# EAGLE design avr_programming_shield_v12 (EAGLE 6.3)
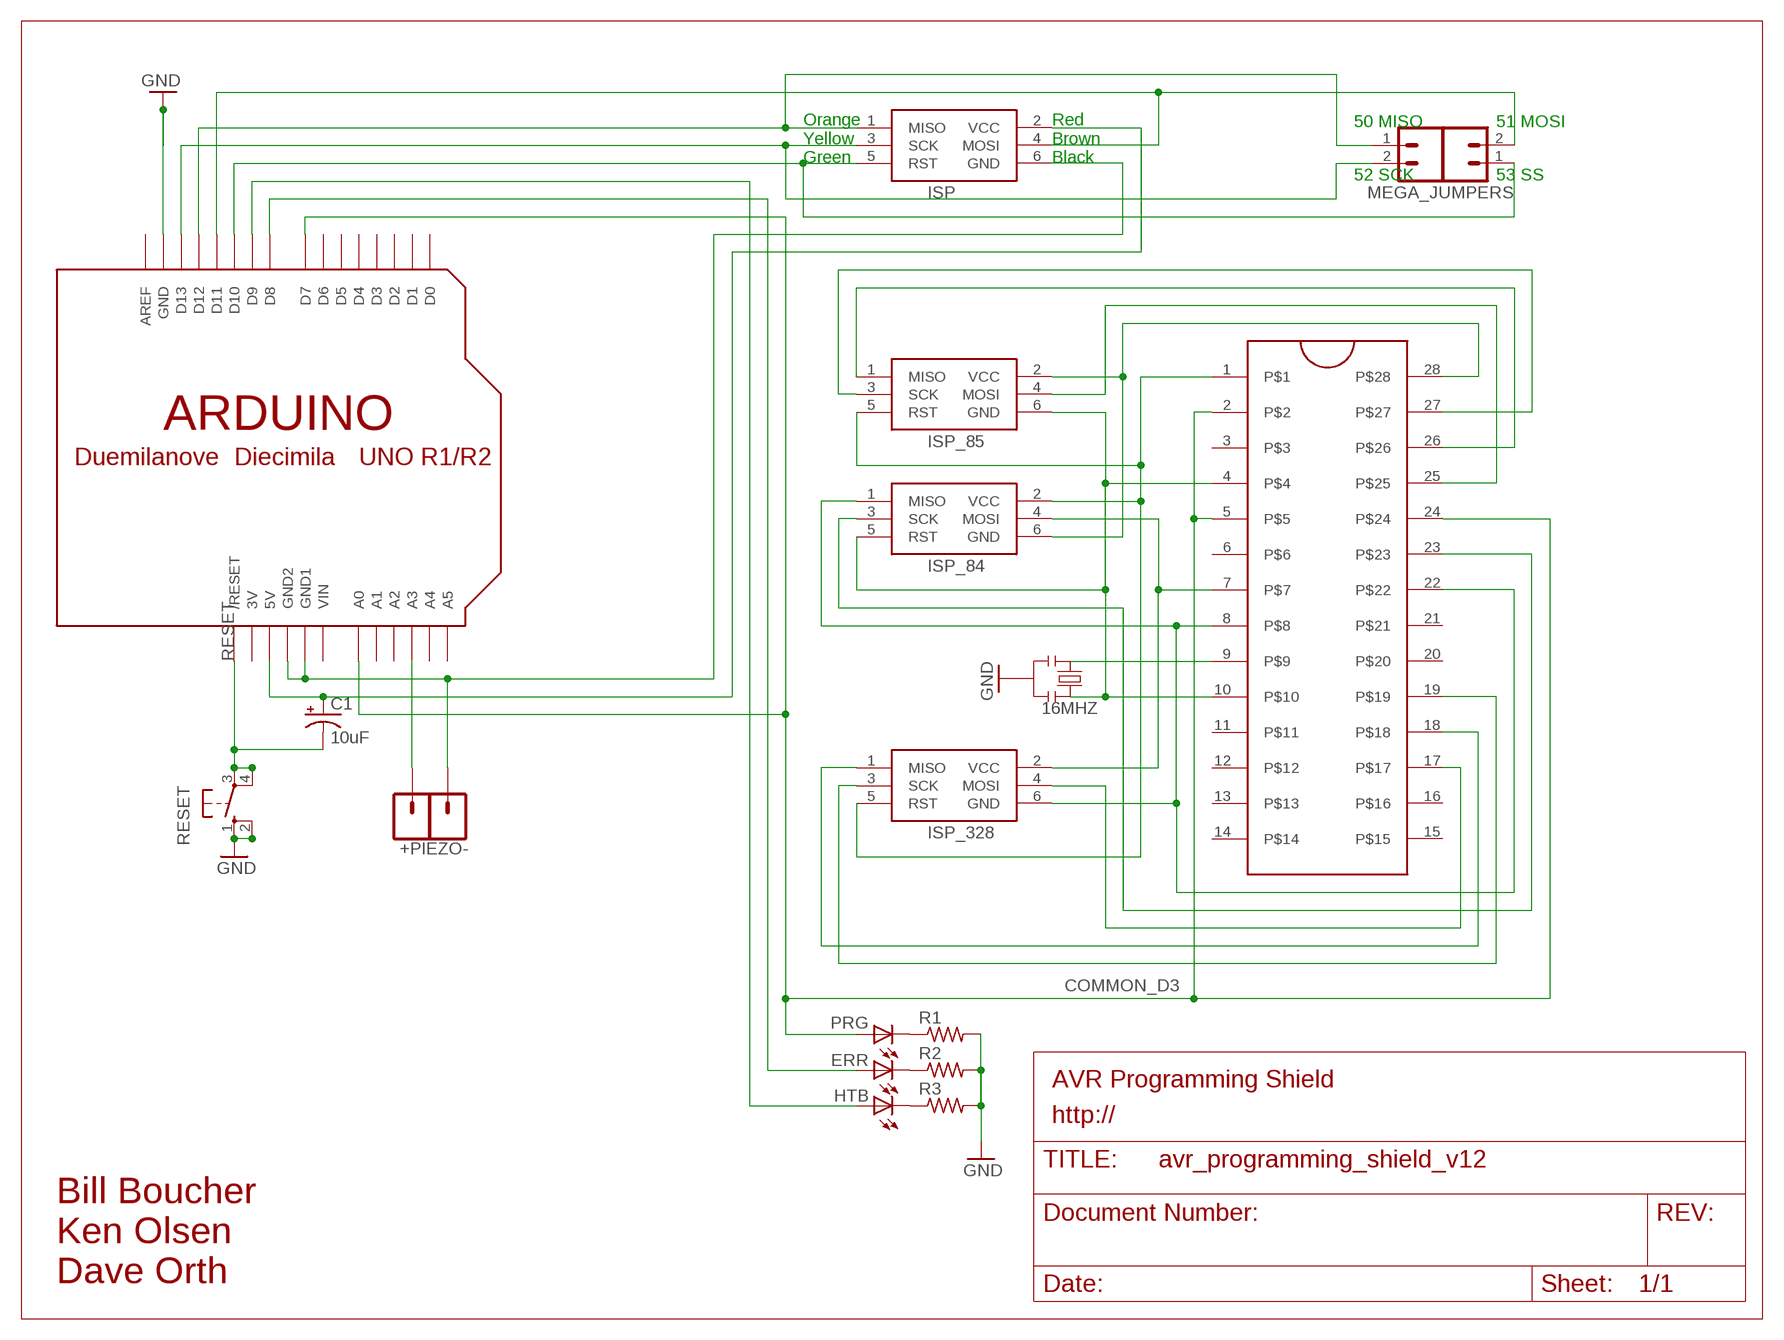
[diagram p0: schematic, sheet 1]

## Parts
16MHZ  RESONATORPTH  [RESONATOR-PTH]
+PIEZO-  M01PTH  [1X01]
C1  10uF  CAP_POLPTH2  [CPOL-RADIAL-10UF-25V]
ERR  LED3MM  [LED3MM]
HTB  LED3MM  [LED3MM]
ISP  AVRISP-6  [AVRISP]
ISP_84  AVRISP-6  [AVRISP]
ISP_85  AVRISP-6  [AVRISP]
ISP_328  AVRISP-6  [AVRISP]
JP2  M02PTH  [1X02]
JP4  M01PTH  [1X01]
MEGA_JUMPERS  M02PTH  [1X02]
PRG  LED3MM  [LED3MM]
R1  R-US_0207/7  [0207/7]
R2  R-US_0207/7  [0207/7]
R3  R-US_0207/7  [0207/7]
RESET  10-XX  [B3F-10XX]
U$4  ZIFSOCKET-28-3ZIFFSOCKET-28-3  [DIL28-3-ZIF_SOCKET]
U$5  ARDUINO-NOHOLE  [ARDUINO-NOHOLE]

## Nets
COMMON_D3: PRG.A U$4.2 U$4.5 U$4.24 U$5.A0 U$5.D7
GND [power]: 16MHZ.2 +PIEZO-.1 ISP.6(GND) R1.2 R2.2 R3.2 RESET.1(S) RESET.2(S1) U$5.GND U$5.GND1 U$5.GND2
N$1: ISP_328.4(MOSI) U$4.17
N$2: ISP.3(SCK) MEGA_JUMPERS.2 U$5.D13
N$3: ISP.1(MISO) MEGA_JUMPERS.1 U$5.D12
N$4: ISP_328.1(MISO) U$4.18
N$5: ISP.5(RST) JP2.1 U$5.D10
N$6: ISP.4(MOSI) JP2.2 U$5.D11
N$7: ISP_328.3(SCK) U$4.19
N$8: PRG.K(C) R1.1
N$9: ERR.K(C) R2.1
N$10: HTB.K(C) R3.1
N$11: ISP_84.4(MOSI) ISP_328.2(VCC) U$4.7
N$12: JP4.1 U$5.A3
N$13: ISP_84.2(VCC) ISP_85.5(RST) ISP_328.5(RST) U$4.1
N$15: ISP_84.3(SCK) U$4.23
N$16: ISP_84.6(GND) ISP_85.2(VCC) U$4.28
N$17: HTB.A U$5.D9
N$18: 16MHZ.3 ISP_84.5(RST) ISP_85.6(GND) U$4.4 U$4.10
N$19: ISP_85.4(MOSI) U$4.25
N$20: ISP_85.1(MISO) U$4.26
N$21: ISP_85.3(SCK) U$4.27
N$22: 16MHZ.1 U$4.9
N$24: ERR.A U$5.D8
N$26: ISP_84.1(MISO) ISP_328.6(GND) U$4.8 U$4.22
RESET: C1.2(-) RESET.3(P) RESET.4(P1) U$5.RESET(/RESET)
VCC: C1.1(+) ISP.2(VCC) U$5.5V
Unconnected: U$4.3 U$4.6 U$4.11 U$4.12 U$4.13 U$4.14 U$4.15 U$4.16 U$4.20 U$4.21 U$5.A1 U$5.A2 U$5.A4 U$5.A5 U$5.AREF U$5.D0 U$5.D1 U$5.D2 U$5.D3 U$5.D4 U$5.D5 U$5.D6

## Notes on the sheet
- 50 MISO | 51 MOSI
- Orange
  Yellow
  Green
- Red
  Brown
  Black
- 52 SCK | 53 SS
- AVR Programming Shield
- http://
- Bill Boucher
  Ken Olsen
  Dave Orth

## Power pins joined to a net without a drawn wire
3V: U$5.3V
VIN: U$5.VIN

## Library data of the parts
16MHZ = SparkFun_mod:RESONATOR: Resonator Small SMD resonator. This is the itty bitty 10/20MHz resonators with built in caps. CSTCE10M0G55 and CSTCE20M0V53. Footprint has been reviewed closely but hasn't been tested yet.; OC_NEWARK: unknown
+PIEZO- JP4 = SparkFun-Connectors_mod:M01: Header 1 Standard 1-pin 0.1" header. Use with straight break away headers (SKU : PRT-00116), right angle break away headers (PRT-00553), swiss pins (PRT-00743), machine pins (PRT-00117), and female headers (PRT-00115).; OC_NEWARK: unknown
C1 = SparkFun:CAP_POL: Capacitor Polarized These are standard SMD and PTH capacitors. Normally 10uF, 47uF, and 100uF in electrolytic and tantalum varieties. Always verify the external diameter of the through hole cap, it varies with capacity, voltage, and manufacturer. The EIA devices should be standard.; MF: ILLINOIS CAPACITOR,INC.; MPN: 106TTA035M; OC_NEWARK: 30K6594
ERR HTB PRG = adafruit:LED: LED OSRAM: - CHIPLED LG R971, LG N971, LY N971, LG Q971, LY Q971, LO R971, LY R971 LH N974, LH R974 LS Q976, LO Q976, LY Q976 LO Q996 - Hyper CHIPLED LW Q18S LB Q993, LB Q99A, LB R99A - SideLED LS A670, LO A670, LY A670, LG A670, LP A670 LB A673, LV A673, LT A673, LW A673 LH A674 LY A675 LS A676, LA A676, LO A676, LY A676, LW A676 LS A679, LY A679, LG A679 - Hyper Micro SIDELED® LS Y876, LA Y876, LO Y876, LY Y876 LT Y87S - SmartLED LW L88C, LW L88S LB L89C, LB L89S, LG L890 LS L89K, LO L89K, LY L89K LS L896, LA L896, LO L896, LY L896 - TOPLED LS T670, LO T670, LY T670, LG T670, LP T670 LSG T670, LSP T670, LSY T670, LOP T670, LYG T670 LG T671, LOG T671, LSG T671 LB T673, LV T673, LT T673, LW T673 LH T674 LS T676, LA T676, LO T676, LY T676, LB T676, LH T676, LSB T676, LW T676 LB T67C, LV T67C, LT T67C, LS T67K, LO T67K, LY T67K, LW E67C LS E67B, LA E67B, LO E67B, LY E67B, LB E67C, LV E67C, LT E67C LW T67C LS T679, LY T679, LG T679 LS T770, LO T770, LY T770, LG T770, LP T770 LB T773, LV T773, LT T773, LW T773 LH T774 LS E675, LA E675, LY E675, LS T675 LS T776, LA T776, LO T776, LY T776, LB T776 LHGB T686 LT T68C, LB T68C - Hyper Mini TOPLED® LB M676 - Mini TOPLED Santana® LG M470 LS M47K, LO M47K, LY M47K Source: http://www.osram.convergy.de/; OC_NEWARK: unknown
ISP ISP_84 ISP_85 ISP_328 = adafruit:AVRISP: AVR ISP HEADER Standard 6 pin header for AVR programming; OC_NEWARK: unknown
JP2 MEGA_JUMPERS = SparkFun:M02: Header 2 Standard 2-pin 0.1" header. Use with straight break away headers (SKU : PRT-00116), right angle break away headers (PRT-00553), swiss pins (PRT-00743), machine pins (PRT-00117), and female headers (PRT-00115). Molex polarized connector foot print use with SKU : PRT-08233 with associated crimp pins and housings.; OC_NEWARK: unknown
R1-R3 = adafruit:R-US_: RESISTOR, American symbol
RESET = switch-omron:10-XX: OMRON SWITCH; MPN: B3F-1000; OC_FARNELL: 176432; OC_NEWARK: 36M3542
U$4 = SparkFun_mod:ZIFSOCKET-28-3; OC_NEWARK: unknown
U$5 = adafruit_mod:ARDUINO: Arduino Diecimila/Duemilanove Make a shield with ease, this package has all the named pins as well as the two mounting drill holes and an outline of the USB and DC power connector. The outline is on the DIMENSION layer, so if your board house uses it they will cut the outline to match. http://www.ladyada.net/library/pcb/eaglelibrary.html

## Net classes
1 power: width 0.61 mm

## Board
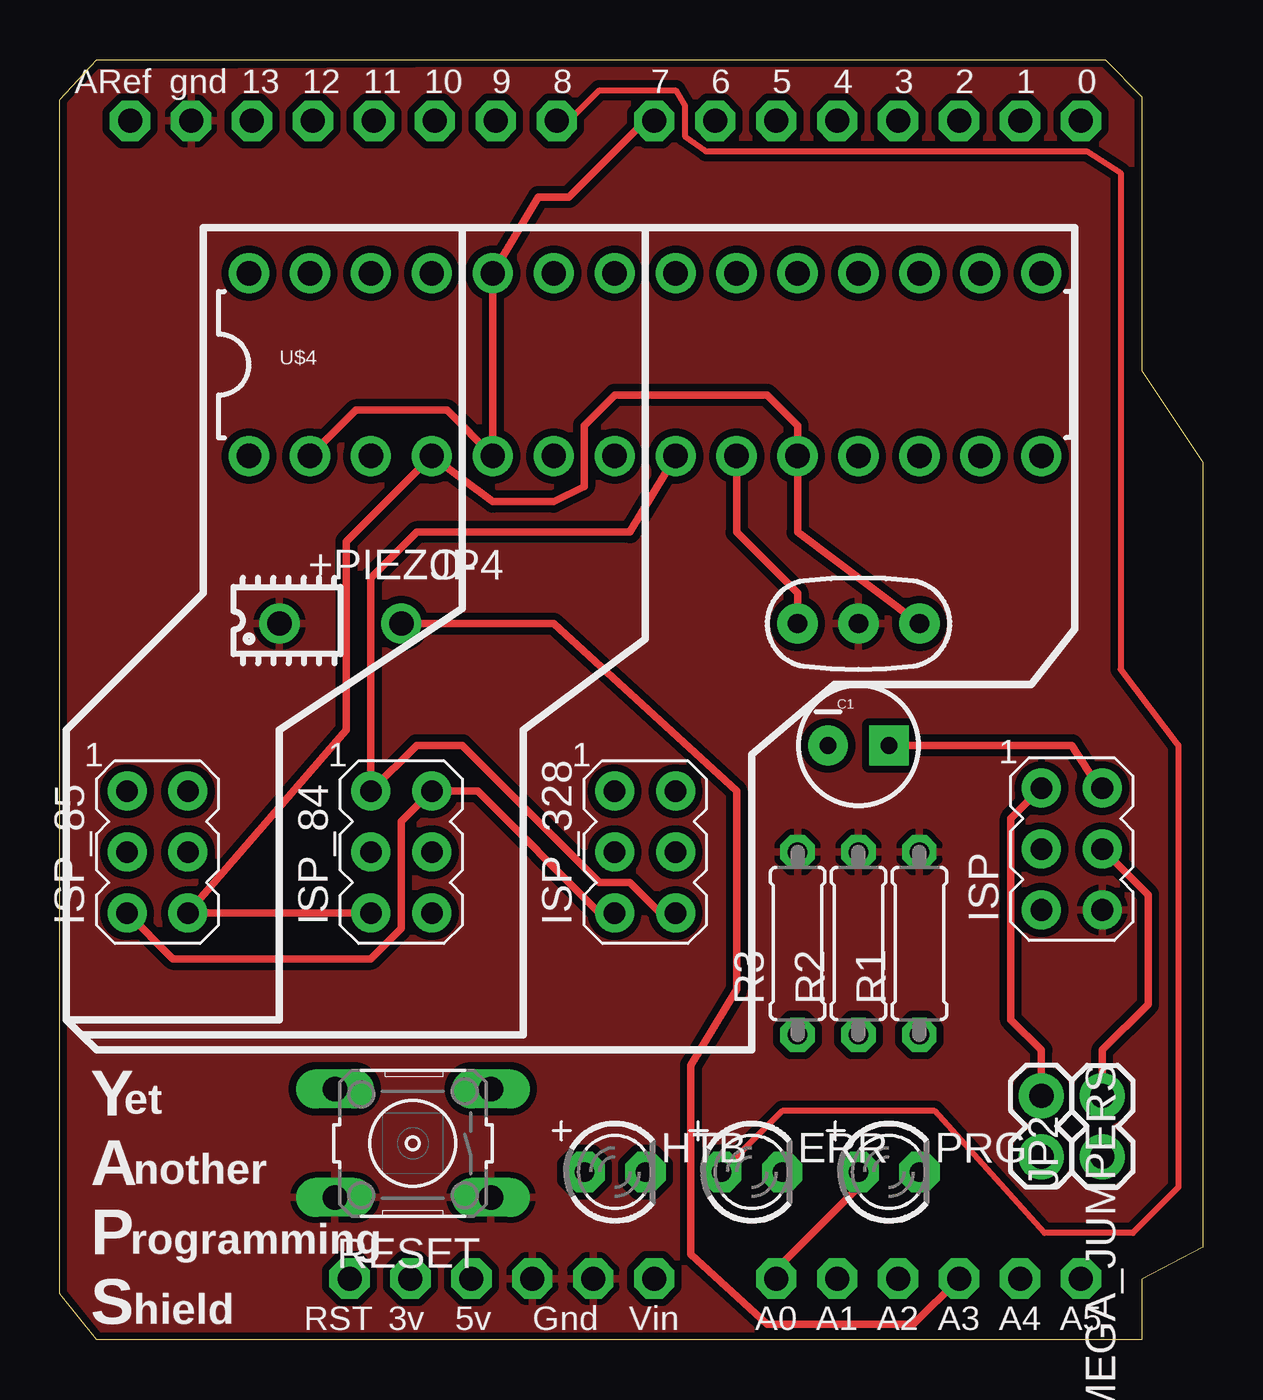
[diagram p1: board, top side]
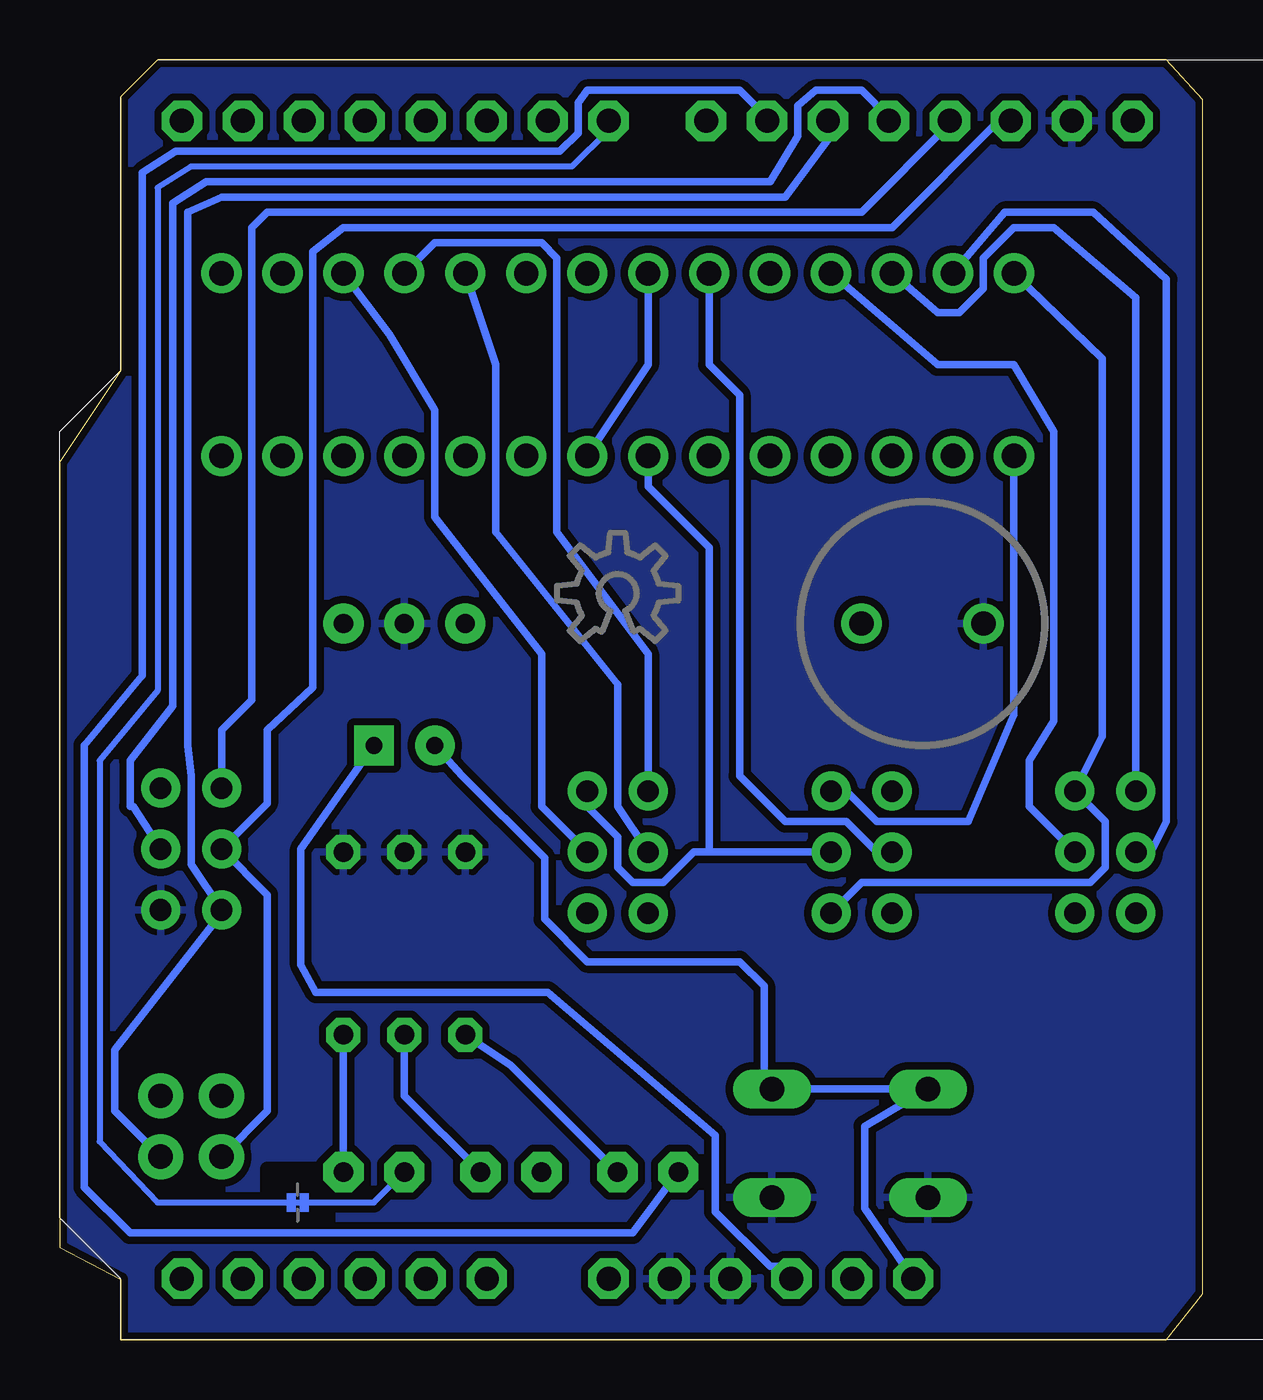
[diagram p2: board, bottom side, seen from below]

Size 47.62 x 53.34 mm. Coordinates in mm from the lower left corner, seen from the top.
Outline: 0,51.69 1.52,53.34 43.56,53.34 45.09,51.82 45.09,40.39 47.62,36.58 47.62,3.83 45.09,2.52 45.09,0 1.52,0 0,1.91 0,51.69
Copper layers (1*16): Top 0.035mm / dielectric 1.5mm / Bottom 0.035mm
Design rules "SparkFun": minimum track width 8mil, minimum drill 20mil, track to track 8mil, track to pad 8mil, pad to pad 8mil, via to via 8mil, smd to smd 8mil, copper to edge 10mil, drill to drill 8mil, minimum pad ring 12mil, minimum via ring 10mil, stop-mask expansion 4mil, vias tented up to drill 25mil, thermal gap 10mil
bRestrict: area 36.4,4.6 to 39,7.1

### Footprints (pad centres in the part's own frame; a part is rotated, then mirrored left to right if it is on the bottom)
RESONATOR-PTH = drill 0.8 pad 1.676: 1 -2.54,0; 2 0,0; 3 2.54,0
1X01 = drill 1.016 pad 1.676: 1 0,0
CPOL-RADIAL-10UF-25V = drill 0.7 pad 1.651 square: 1 1.27,0 | drill 0.7 pad 1.651: 2 -1.27,0
LED3MM = drill 0.813 pad 1.676 octagon: A -1.27,0; K 1.27,0
AVRISP = drill 0.9 pad 1.626: 1 -1.27,2.54; 2 1.27,2.54; 3 -1.27,0; 4 1.27,0; 5 -1.27,-2.54; 6 1.27,-2.54
1X02 = drill 1.016 pad 1.88: 1 0,0; 2 2.54,0
0207/7 = drill 0.813 octagon: 1 -3.81,0; 2 3.81,0
B3F-10XX = drill 1.016 long: 1 -3.251,2.261; 2 3.251,2.261; 3 -3.251,-2.261; 4 3.251,-2.261
DIL28-3-ZIF_SOCKET = drill 1.016 pad 1.676: 1 -16.51,-3.81; 2 -13.97,-3.81; 3 -11.43,-3.81; 4 -8.89,-3.81; 5 -6.35,-3.81; 6 -3.81,-3.81; 7 -1.27,-3.81; 8 1.27,-3.81; 9 3.81,-3.81; 10 6.35,-3.81; 11 8.89,-3.81; 12 11.43,-3.81; 13 13.97,-3.81; 14 16.51,-3.81; 15 16.51,3.81; 16 13.97,3.81; 17 11.43,3.81; 18 8.89,3.81; 19 6.35,3.81; 20 3.81,3.81; 21 1.27,3.81; 22 -1.27,3.81; 23 -3.81,3.81; 24 -6.35,3.81; 25 -8.89,3.81; 26 -11.43,3.81; 27 -13.97,3.81; 28 -16.51,3.81
ARDUINO-NOHOLE = drill 1 pad 1.676 octagon: 3V 35.56,2.54; 5V 38.1,2.54; A0 50.8,2.54; A1 53.34,2.54; A2 55.88,2.54; A3 58.42,2.54; A4 60.96,2.54; A5 63.5,2.54; AREF 23.876,50.8; D0 63.5,50.8; D1 60.96,50.8; D2 58.42,50.8; D3 55.88,50.8; D4 53.34,50.8; D5 50.8,50.8; D6 48.26,50.8; D7 45.72,50.8; D8 41.656,50.8; D9 39.116,50.8; D10 36.576,50.8; D11 34.036,50.8; D12 31.496,50.8; D13 28.956,50.8; GND 26.416,50.8; GND1 43.18,2.54; GND2 40.64,2.54; RESET 33.02,2.54; VIN 45.72,2.54

### Placement (x,y rotation side)
16MHZ  33.27,29.84 0 top
+PIEZO-  9.14,29.84 0 top
C1  33.27,24.77 0 top
ERR  28.83,6.99 0 top
HTB  23.13,6.99 0 top
ISP  42.16,20.45 0 top
ISP_84  14.22,20.32 0 top
ISP_85  4.06,20.32 0 top
ISP_328  24.38,20.32 0 top
JP2  43.43,7.62 90 top
JP4  14.22,29.84 0 top
MEGA_JUMPERS  40.89,10.16 270 top
PRG  34.54,6.99 0 top
R1  35.81,16.51 90 top
R2  33.27,16.51 90 top
R3  30.73,16.51 90 top
RESET  14.71,8.18 180 top
U$2  [OSHWLOGO_BOTTOM]  24.38,31.11 0 top
U$4  24.38,40.64 0 top
U$5  -20.95,0 0 top

### Tracks (layer width: path | path; a pad name or v marks a point on that pad's centre or on a via)
COMMON_D3
  Top 0.305: U$4.2 12.32,38.73 16.13,38.73 U$4.5 U$4.24 19.94,47.62 21.21,47.62 24.38,50.8 U$5.D7 | U$5.A0 29.84,2.92 33.27,6.35 PRG.A
  Bottom 0.254: U$5.D7 24.77,50.42 26.29,48.9 42.16,48.9 43.56,48.01 43.56,27.05 45.97,24.13 45.97,8.26 43.56,5.71 34.54,5.71 PRG.A
GND
  pour Bottom (isolate 0.305): -18.41,53.34 48.26,53.98 47.62,-1.14 -19.05,-0.64
  pour Top (isolate 0.305): -18.41,52.7 48.01,53.09 47.75,-0.38 -18.41,-1.02
N$1
  Bottom 0.305: U$4.17 33.91,41.91 32,38.73 32,34.29 27.56,28.57 27.56,22.23 ISP_328.4
N$2
  Bottom 0.305: MEGA_JUMPERS.2 38.99,9.53 38.99,18.54 ISP.3 38.99,22.35 38.99,25.4 37.08,27.18 37.08,45.34 35.81,46.35 12.95,46.35 8.51,50.8 U$5.D13
N$3
  Top 0.305: MEGA_JUMPERS.1 40.89,12.06 39.62,13.34 39.62,21.72 ISP.1
  Bottom 0.305: ISP.1 40.89,25.4 39.62,26.67 39.62,46.35 38.99,46.99 14.22,46.99 10.54,50.67 U$5.D12
N$4
  Bottom 0.305: U$4.18 32,45.72 27.56,45.72 26.92,45.09 26.92,33.66 23.11,28.57 ISP_328.1
N$5
  Bottom 0.305: JP2.1 45.34,9.53 45.34,12.06 40.89,17.78 ISP.5 42.16,19.81 42.16,23.5 42.29,24.77 42.29,46.99 40.89,47.62 17.4,47.62 15.62,50.04 U$5.D10
N$6
  Top 0.305: JP2.2 43.43,12.06 45.34,13.97 45.34,18.54 ISP.4
  Bottom 0.305: ISP.4 44.58,22.23 44.7,22.23 44.7,24.13 42.93,26.42 42.93,47.37 41.53,48.26 18.03,48.26 16.89,50.16 16.89,51.44 16.13,52.07 14.22,52.07 13.08,50.93 U$5.D11
N$7
  Bottom 0.305: U$4.19 29.46,40.64 29.46,33.66 24.38,27.3 24.38,22.23 ISP_328.3
N$8
  Bottom 0.305: R1.1 PRG.K
N$9
  Bottom 0.305: R2.1 33.27,10.16 ERR.K
N$10
  Bottom 0.305: R3.1 28.84,11.43 HTB.K
N$11
  Bottom 0.305: ISP_328.2 25.65,22.23 24.38,20.95 24.38,19.68 23.75,19.05 22.48,19.05 21.21,20.32 20.57,20.32 | 20.57,20.32 ISP_84.4 | U$4.7 23.11,35.56 20.57,33.02 20.57,20.32
N$12
  Top 0.305: JP4.1 20.57,29.84 28.19,22.86 28.19,14.61 26.29,11.43 26.29,3.56 29.46,0.64 35.56,0.64 U$5.A3
N$13
  Top 0.305: ISP_85.5 4.7,15.88 12.95,15.88 14.22,17.14 14.22,21.59 ISP_84.2 17.4,22.86 22.48,17.78 ISP_328.5
  Bottom 0.305: U$4.1 7.87,26.04 9.78,21.59 13.59,21.59 14.86,22.86 ISP_84.2
N$15
  Bottom 0.305: U$4.23 20.57,40.64 19.3,39.37 19.3,23.5 17.4,21.59 14.86,21.59 13.59,20.32 ISP_84.3
N$16
  Bottom 0.305: U$4.28 4.19,40.89 4.19,25.15 ISP_85.2 4.06,21.59 4.06,19.68 4.7,19.05 14.22,19.05 ISP_84.6
N$17
  Bottom 0.305: HTB.A 23.76,4.45 44.7,4.45 46.61,6.35 46.61,24.77 44.2,27.69 44.2,48.64 42.8,49.53 26.8,49.53 26.04,50.29 26.04,51.56 25.65,52.07 19.3,52.07 18.16,50.93 U$5.D9
N$18
  Top 0.305: ISP_84.5 ISP_85.6 11.94,25.4 11.94,33.27 U$4.4 18.03,34.92 20.57,34.92 21.84,35.56 21.84,38.1 23.11,39.37 29.46,39.37 30.73,38.1 U$4.10 30.73,33.66 16MHZ.3
N$19
  Bottom 0.305: U$4.25 11.05,40.64 7.87,40.64 6.22,37.85 6.22,25.78 7.24,24.13 7.24,22.23 ISP_85.4
N$20
  Bottom 0.305: ISP_85.1 2.79,43.43 6.22,46.35 7.87,46.35 9.14,45.09 9.14,43.81 10.16,42.8 11.05,42.8 U$4.26
N$21
  Bottom 0.305: ISP_85.3 2.16,20.32 1.52,21.59 1.52,44.2 4.57,46.99 8.26,46.99 U$4.27
N$22
  Top 0.305: U$4.9 28.19,33.66 30.73,31.11 16MHZ.1
N$24
  Top 0.254: U$5.D8 21.21,50.8 22.48,52.07 25.65,52.07 26.04,51.44 26.04,50.16 26.92,49.53 42.8,49.53 44.2,48.64 44.2,27.94 46.61,24.77 46.61,6.35 44.7,4.45 41.02,4.45 36.45,9.53 30.1,9.53 ERR.A
N$26
  Top 0.305: ISP_328.6 25.02,17.78 23.75,19.05 22.48,19.05 16.76,24.77 14.86,24.77 ISP_84.1 12.95,31.75 14.86,33.66 23.75,33.66 U$4.8
  Bottom 0.305: U$4.22 23.11,40.64 U$4.8
RESET
  Bottom 0.305: U$5.RESET 14.1,5.46 14.1,8.89 RESET.4 RESET.3 18.29,10.77 18.29,14.73 19.3,15.75 25.65,15.75 27.43,17.53 27.43,20.07 30.86,23.5 C1.2
VCC
  Top 0.305: ISP.2 43.31,22.99 42.16,24.77 C1.1
  Bottom 0.305: 34.54,24.64 C1.1 37.59,20.45 37.59,15.62 36.96,14.48 27.3,14.48 20.32,8.51 20.32,5.33 18.03,3.05 17.65,3.05 U$5.5V
(copper drawn outside any net)
  shapes: Bottom area x2

### Text on the board
tPlace: et | nother | rogramming | Y / A / P / S | hield
tDocu: VCC | GND | 45/85 | 44/84 | 168/328 | ISP | 50 | 51 | (D3) | 52 | 53 | Reset | Heart | Error | Prog | Mega / Jumpers
bDocu: MakersBox.blogspot.com | Avr Programming Shield / Apr 2013 | piezo | (opt.) | Open Source / Hardware